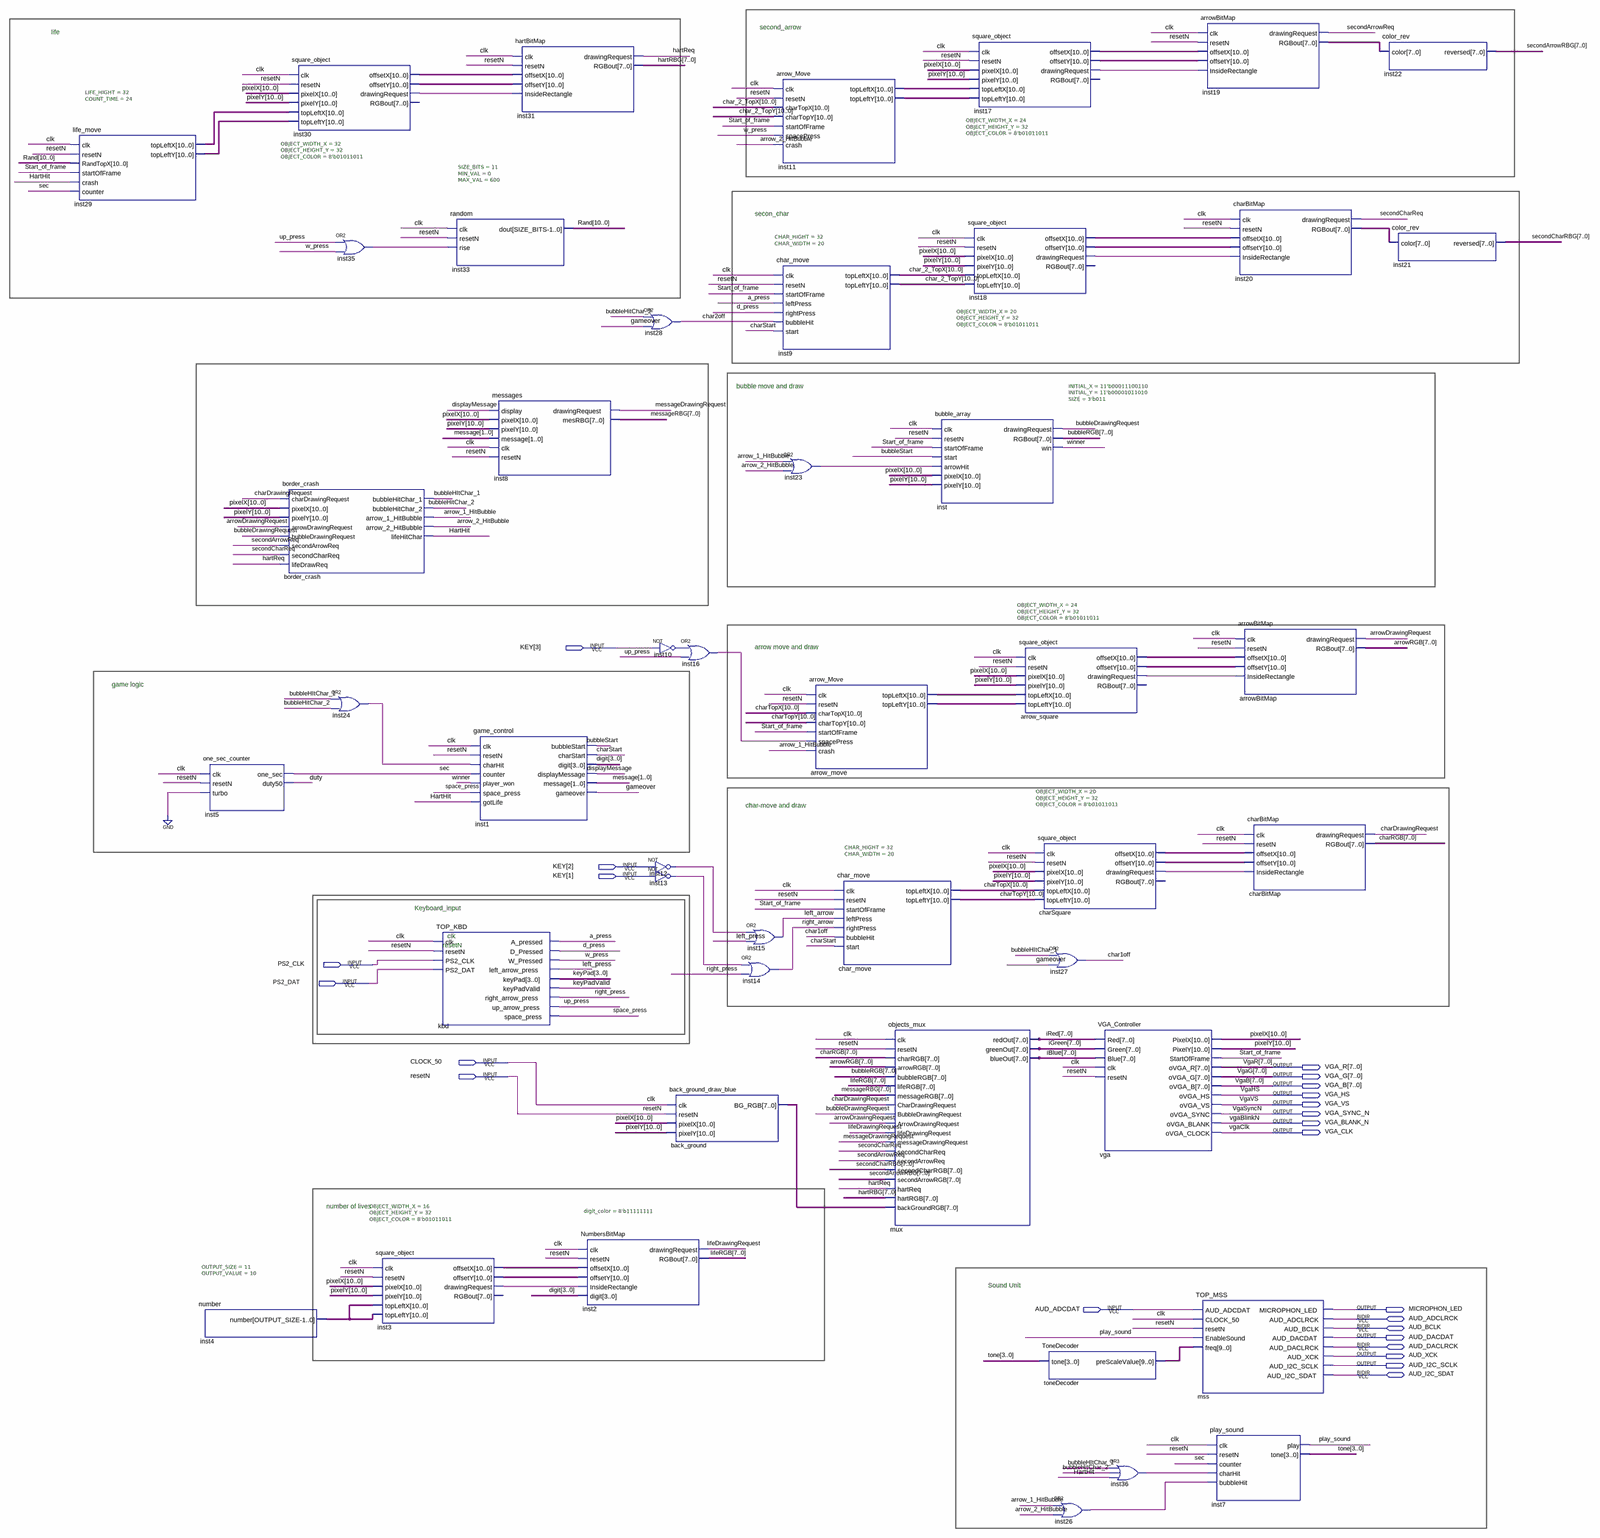
[diagram p0: schematic sheet, whole]
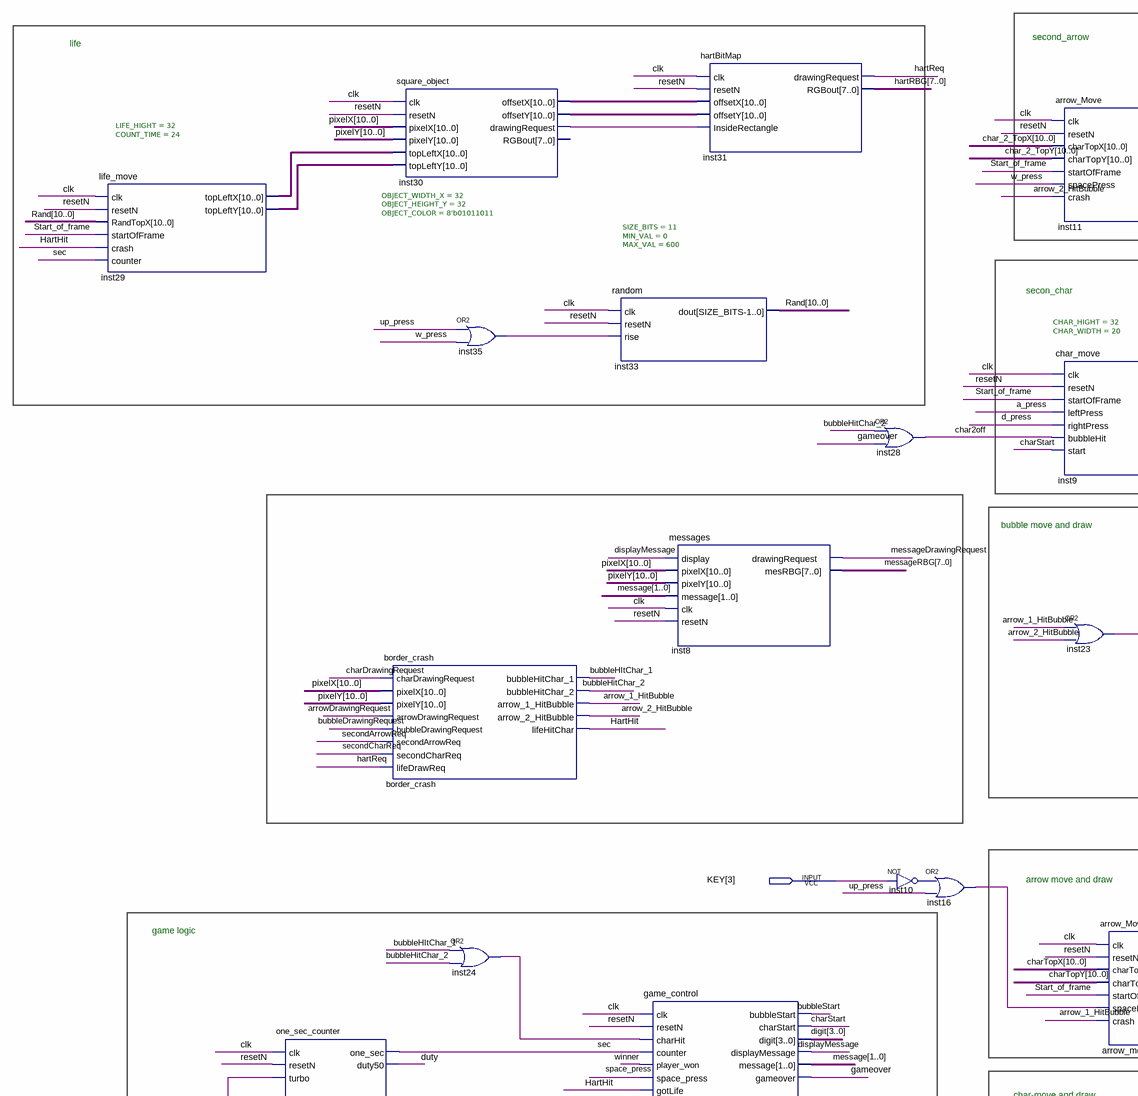
[diagram p1: schematic sheet, upper left part]
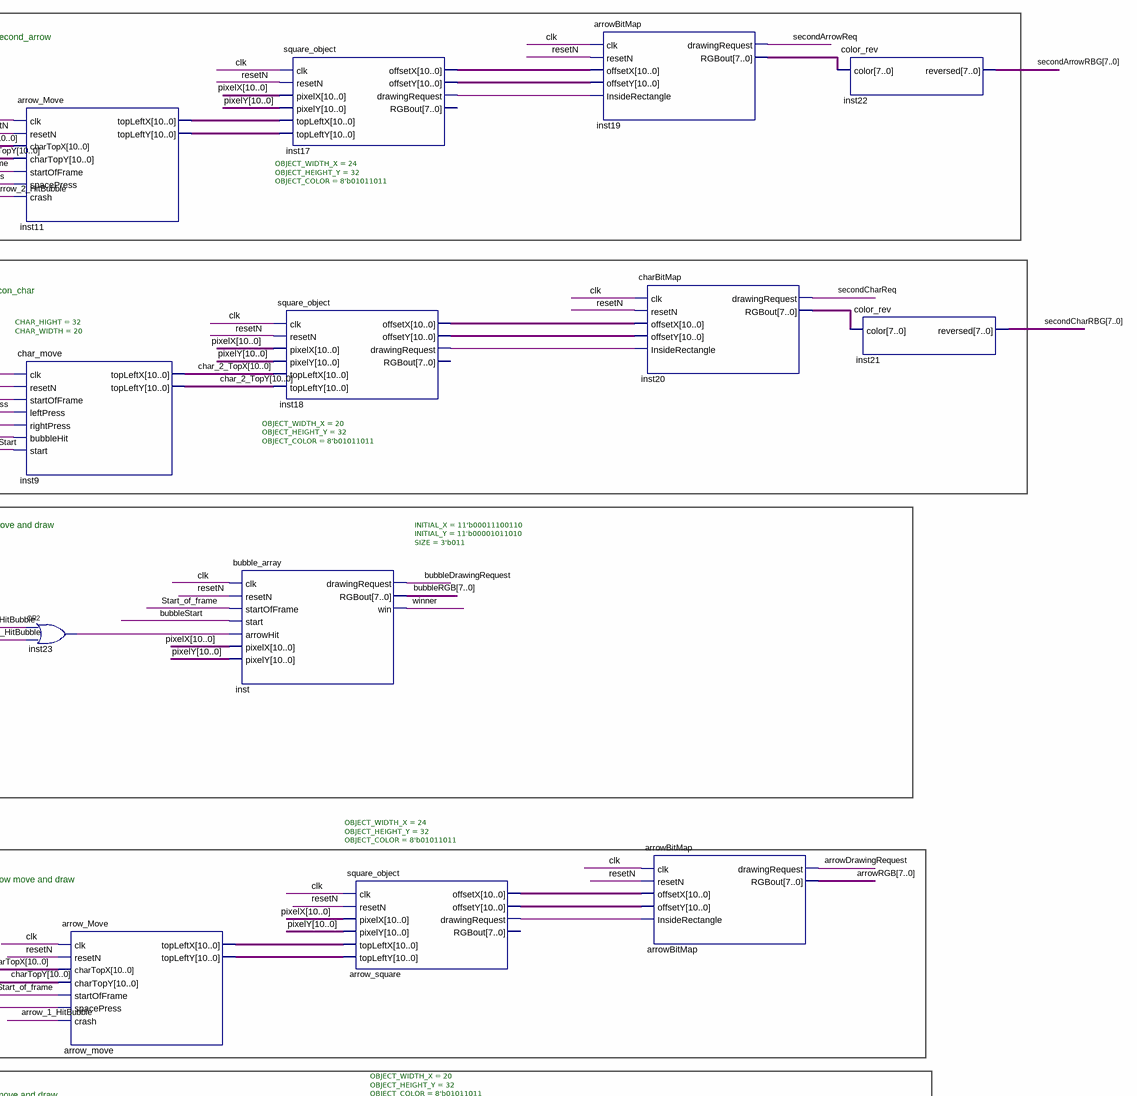
[diagram p2: schematic sheet, upper right part]
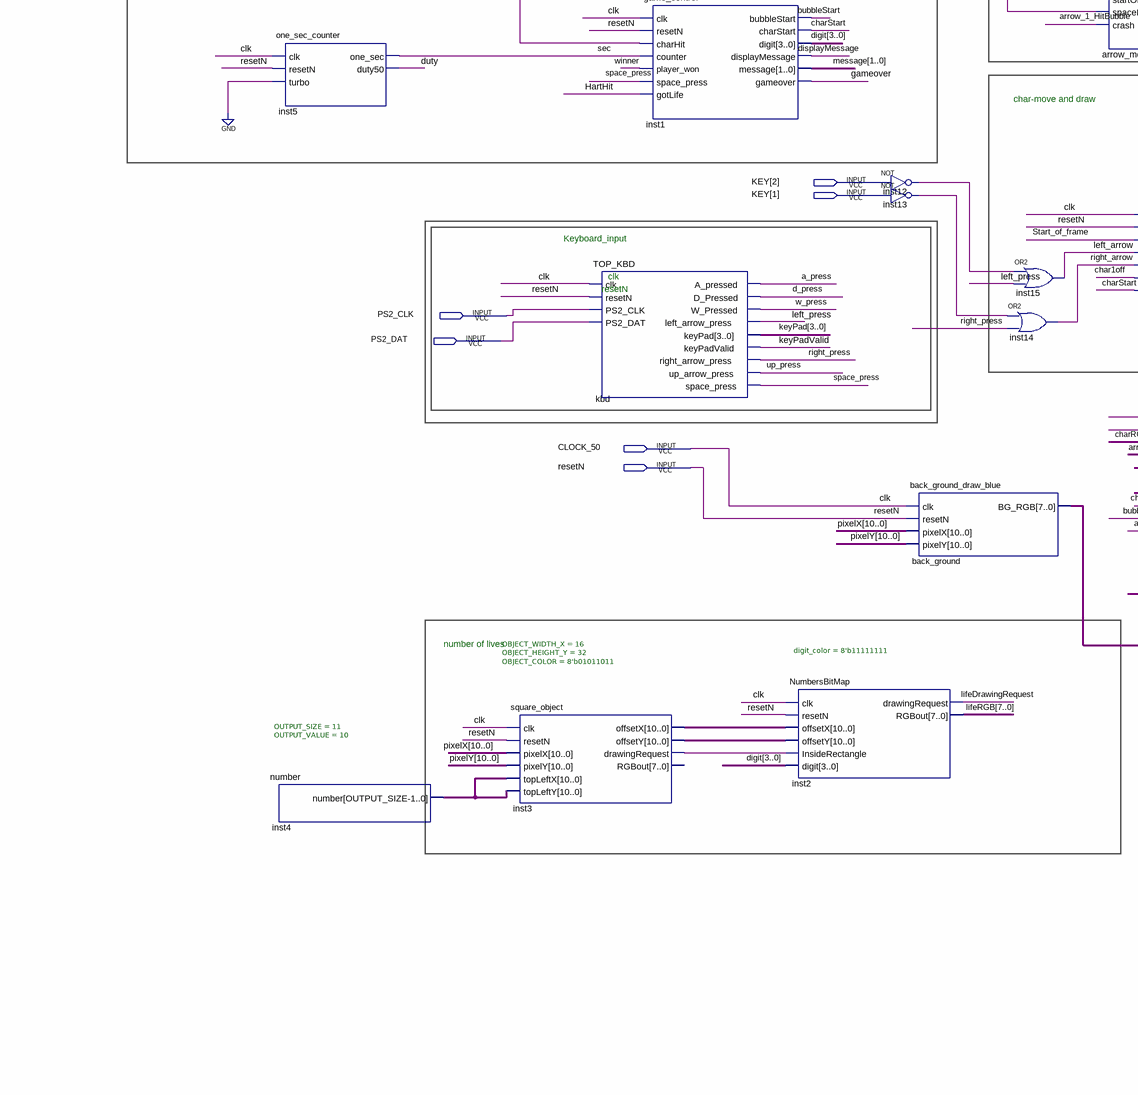
[diagram p3: schematic sheet, lower left part]
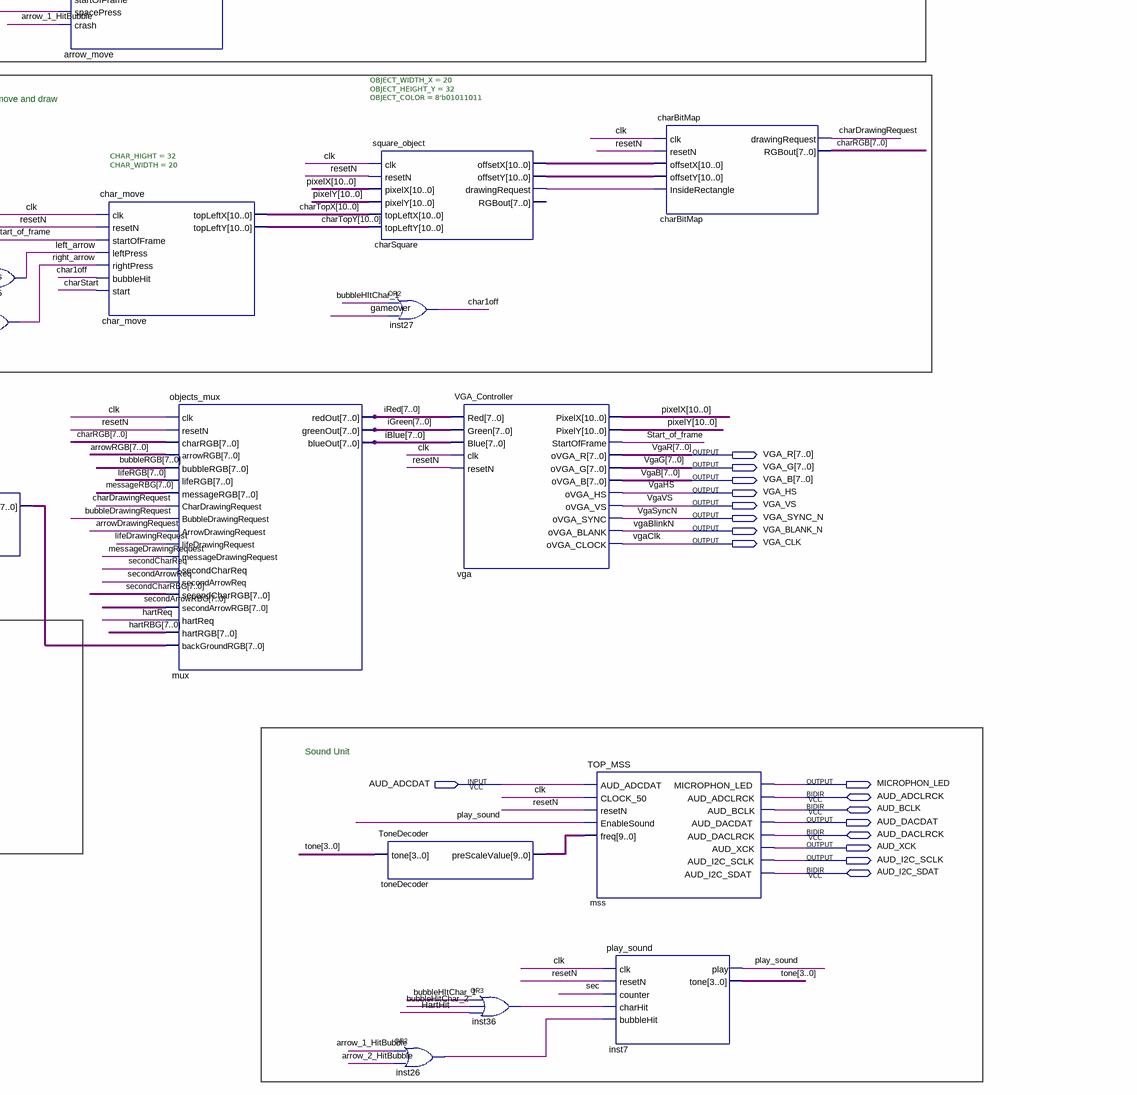
[diagram p4: schematic sheet, lower right part]
// Quartus schematic bubble-trouble-fpga.bdf as structural Verilog: 46 symbols, 24 pins
module \bubble-trouble-fpga  (
  input  [3:1] KEY,
  input  PS2_CLK,
  input  PS2_DAT,
  input  CLOCK_50,
  input  resetN,
  input  AUD_ADCDAT,
  inout  AUD_ADCLRCK,
  inout  AUD_BCLK,
  inout  AUD_DACLRCK,
  inout  AUD_I2C_SDAT,
  output [7:0] VGA_R,
  output [7:0] VGA_G,
  output [7:0] VGA_B,
  output VGA_HS,
  output VGA_VS,
  output VGA_SYNC_N,
  output VGA_BLANK_N,
  output VGA_CLK,
  output MICROPHON_LED,
  output AUD_DACDAT,
  output AUD_XCK,
  output AUD_I2C_SCLK
);

  wire a_press, arrow_1_HitBubble, arrow_2_HitBubble, arrow_square_drawingrequest, arrowDrawingRequest,
       bubbleDrawingRequest, bubbleHItChar_1, bubbleHitChar_2, bubbleStart, char1off, char2off,
       charDrawingRequest, charSquare_drawingrequest, charStart, d_press, displayMessage, duty, gameover,
       HartHit, hartReq, inst3_drawingrequest, inst10_out, inst12_out, inst13_out, inst16_out,
       inst17_drawingrequest, inst18_drawingrequest, inst23_out, inst24_out, inst26_out,
       inst30_drawingrequest, inst35_out, inst36_out, keyPadValid, left_arrow, left_press,
       lifeDrawingRequest, messageDrawingRequest, play_sound, right_arrow, right_press, sec, secondArrowReq,
       secondCharReq, space_press, Start_of_frame, up_press, w_press, winner;
  wire [1:0] message;
  wire [3:0] digit, keyPad, tone;
  wire [7:0] arrowRGB, back_ground_bg_rgb, bubbleRGB, charRGB, hartRBG, iBlue, iGreen, inst19_rgbout,
       inst20_rgbout, iRed, lifeRGB, messageRBG, secondArrowRBG, secondCharRBG;
  wire [9:0] toneDecoder_prescalevalue;
  wire [10:0] arrow_move_topleftx, arrow_move_toplefty, arrow_square_offsetx, arrow_square_offsety,
       char_2_TopX, char_2_TopY, charSquare_offsetx, charSquare_offsety, charTopX, charTopY, inst3_offsetx,
       inst3_offsety, inst4_number, inst11_topleftx, inst11_toplefty, inst17_offsetx, inst17_offsety,
       inst18_offsetx, inst18_offsety, inst29_topleftx, inst29_toplefty, inst30_offsetx, inst30_offsety,
       pixelX, pixelY, Rand;

  life_move #(.LIFE_HIGHT(32), .COUNT_TIME(24)) inst29 (
    .clk(CLOCK_50), .resetN(resetN), .RandTopX(Rand), .startOfFrame(Start_of_frame), .crash(HartHit),
    .counter(sec), .topLeftX(inst29_topleftx), .topLeftY(inst29_toplefty));
  one_sec_counter inst5 (.clk(CLOCK_50), .resetN(resetN), .turbo(1'b0), .one_sec(sec), .duty50(duty));
  number #(.OUTPUT_SIZE(11), .OUTPUT_VALUE(10)) inst4 (.number(inst4_number));
  square_object #(.OBJECT_WIDTH_X(32), .OBJECT_HEIGHT_Y(32), .OBJECT_COLOR(8'b01011011)) inst30 (
    .clk(CLOCK_50), .resetN(resetN), .pixelX(pixelX), .pixelY(pixelY), .topLeftX(inst29_topleftx),
    .topLeftY(inst29_toplefty), .offsetX(inst30_offsetx), .offsetY(inst30_offsety),
    .drawingRequest(inst30_drawingrequest));  // open: RGBout
  border_crash border_crash (
    .charDrawingRequest(charDrawingRequest), .pixelX(pixelX), .pixelY(pixelY),
    .arrowDrawingRequest(arrowDrawingRequest), .bubbleDrawingRequest(bubbleDrawingRequest),
    .secondArrowReq(secondArrowReq), .secondCharReq(secondCharReq), .lifeDrawReq(hartReq),
    .bubbleHitChar_1(bubbleHItChar_1), .bubbleHitChar_2(bubbleHitChar_2),
    .arrow_1_HitBubble(arrow_1_HitBubble), .arrow_2_HitBubble(arrow_2_HitBubble), .lifeHitChar(HartHit));
  or inst24 (inst24_out, bubbleHItChar_1, bubbleHitChar_2);
  or inst35 (inst35_out, up_press, w_press);
  square_object #(.OBJECT_WIDTH_X(16), .OBJECT_HEIGHT_Y(32), .OBJECT_COLOR(8'b01011011)) inst3 (
    .clk(CLOCK_50), .resetN(resetN), .pixelX(pixelX), .pixelY(pixelY), .topLeftX(inst4_number),
    .topLeftY(inst4_number), .offsetX(inst3_offsetx), .offsetY(inst3_offsety),
    .drawingRequest(inst3_drawingrequest));  // open: RGBout
  TOP_KBD kbd (
    .clk(CLOCK_50), .resetN(resetN), .PS2_CLK(PS2_CLK), .PS2_DAT(PS2_DAT), .A_pressed(a_press),
    .D_Pressed(d_press), .W_Pressed(w_press), .left_arrow_press(left_press), .keyPad(keyPad),
    .keyPadValid(keyPadValid), .right_arrow_press(right_press), .up_arrow_press(up_press),
    .space_press(space_press));
  random #(.SIZE_BITS(11), .MIN_VAL(0), .MAX_VAL(600)) inst33 (
    .clk(CLOCK_50), .resetN(resetN), .rise(inst35_out), .dout(Rand));
  game_control inst1 (
    .clk(CLOCK_50), .resetN(resetN), .charHit(inst24_out), .counter(sec), .player_won(winner),
    .space_press(space_press), .gotLife(HartHit), .bubbleStart(bubbleStart), .charStart(charStart),
    .digit(digit), .displayMessage(displayMessage), .message(message), .gameover(gameover));
  hartBitMap inst31 (
    .clk(CLOCK_50), .resetN(resetN), .offsetX(inst30_offsetx), .offsetY(inst30_offsety),
    .InsideRectangle(inst30_drawingrequest), .drawingRequest(hartReq), .RGBout(hartRBG));
  messages inst8 (
    .display(displayMessage), .pixelX(pixelX), .pixelY(pixelY), .message(message), .clk(CLOCK_50),
    .resetN(resetN), .drawingRequest(messageDrawingRequest), .mesRBG(messageRBG));
  NumbersBitMap #(.digit_color(8'b11111111)) inst2 (
    .clk(CLOCK_50), .resetN(resetN), .offsetX(inst3_offsetx), .offsetY(inst3_offsety),
    .InsideRectangle(inst3_drawingrequest), .digit(digit), .drawingRequest(lifeDrawingRequest),
    .RGBout(lifeRGB));
  or inst28 (char2off, bubbleHitChar_2, gameover);
  not inst10 (inst10_out, KEY[3]);
  not inst12 (inst12_out, KEY[2]);
  not inst13 (inst13_out, KEY[1]);
  back_ground_draw_blue back_ground (
    .clk(CLOCK_50), .resetN(resetN), .pixelX(pixelX), .pixelY(pixelY), .BG_RGB(back_ground_bg_rgb));
  or inst16 (inst16_out, inst10_out, up_press);
  or inst14 (right_arrow, inst13_out, right_press);
  arrow_Move inst11 (
    .clk(CLOCK_50), .resetN(resetN), .charTopX(char_2_TopX), .charTopY(char_2_TopY),
    .startOfFrame(Start_of_frame), .spacePress(w_press), .crash(arrow_2_HitBubble),
    .topLeftX(inst11_topleftx), .topLeftY(inst11_toplefty));
  char_move #(.CHAR_HIGHT(32), .CHAR_WIDTH(20)) inst9 (
    .clk(CLOCK_50), .resetN(resetN), .startOfFrame(Start_of_frame), .leftPress(a_press),
    .rightPress(d_press), .bubbleHit(char2off), .start(charStart), .topLeftX(char_2_TopX),
    .topLeftY(char_2_TopY));
  or inst15 (left_arrow, inst12_out, left_press);
  or inst23 (inst23_out, arrow_1_HitBubble, arrow_2_HitBubble);
  arrow_Move arrow_move (
    .clk(CLOCK_50), .resetN(resetN), .charTopX(charTopX), .charTopY(charTopY), .startOfFrame(Start_of_frame),
    .spacePress(inst16_out), .crash(arrow_1_HitBubble), .topLeftX(arrow_move_topleftx),
    .topLeftY(arrow_move_toplefty));
  char_move #(.CHAR_HIGHT(32), .CHAR_WIDTH(20)) char_move (
    .clk(CLOCK_50), .resetN(resetN), .startOfFrame(Start_of_frame), .leftPress(left_arrow),
    .rightPress(right_arrow), .bubbleHit(char1off), .start(charStart), .topLeftX(charTopX),
    .topLeftY(charTopY));
  objects_mux mux (
    .clk(CLOCK_50), .resetN(resetN), .charRGB(charRGB), .arrowRGB(arrowRGB), .bubbleRGB(bubbleRGB),
    .lifeRGB(lifeRGB), .messageRGB(messageRBG), .CharDrawingRequest(charDrawingRequest),
    .BubbleDrawingRequest(bubbleDrawingRequest), .ArrowDrawingRequest(arrowDrawingRequest),
    .lifeDrawingRequest(lifeDrawingRequest), .messageDrawingRequest(messageDrawingRequest),
    .secondCharReq(secondCharReq), .secondArrowReq(secondArrowReq), .secondCharRGB(secondCharRBG),
    .secondArrowRGB(secondArrowRBG), .hartReq(hartReq), .hartRGB(hartRBG),
    .backGroundRGB(back_ground_bg_rgb), .redOut(iRed), .greenOut(iGreen), .blueOut(iBlue));
  square_object #(.OBJECT_WIDTH_X(20), .OBJECT_HEIGHT_Y(32), .OBJECT_COLOR(8'b01011011)) inst18 (
    .clk(CLOCK_50), .resetN(resetN), .pixelX(pixelX), .pixelY(pixelY), .topLeftX(char_2_TopX),
    .topLeftY(char_2_TopY), .offsetX(inst18_offsetx), .offsetY(inst18_offsety),
    .drawingRequest(inst18_drawingrequest));  // open: RGBout
  bubble_array #(.INITIAL_X(11'b00011100110), .INITIAL_Y(11'b00001011010), .SIZE(3'b011)) inst (
    .clk(CLOCK_50), .resetN(resetN), .startOfFrame(Start_of_frame), .start(bubbleStart),
    .arrowHit(inst23_out), .pixelX(pixelX), .pixelY(pixelY), .drawingRequest(bubbleDrawingRequest),
    .RGBout(bubbleRGB), .win(winner));
  square_object #(.OBJECT_WIDTH_X(24), .OBJECT_HEIGHT_Y(32), .OBJECT_COLOR(8'b01011011)) inst17 (
    .clk(CLOCK_50), .resetN(resetN), .pixelX(pixelX), .pixelY(pixelY), .topLeftX(inst11_topleftx),
    .topLeftY(inst11_toplefty), .offsetX(inst17_offsetx), .offsetY(inst17_offsety),
    .drawingRequest(inst17_drawingrequest));  // open: RGBout
  square_object #(.OBJECT_WIDTH_X(24), .OBJECT_HEIGHT_Y(32), .OBJECT_COLOR(8'b01011011)) arrow_square (
    .clk(CLOCK_50), .resetN(resetN), .pixelX(pixelX), .pixelY(pixelY), .topLeftX(arrow_move_topleftx),
    .topLeftY(arrow_move_toplefty), .offsetX(arrow_square_offsetx), .offsetY(arrow_square_offsety),
    .drawingRequest(arrow_square_drawingrequest));  // open: RGBout
  square_object #(.OBJECT_WIDTH_X(20), .OBJECT_HEIGHT_Y(32), .OBJECT_COLOR(8'b01011011)) charSquare (
    .clk(CLOCK_50), .resetN(resetN), .pixelX(pixelX), .pixelY(pixelY), .topLeftX(charTopX),
    .topLeftY(charTopY), .offsetX(charSquare_offsetx), .offsetY(charSquare_offsety),
    .drawingRequest(charSquare_drawingrequest));  // open: RGBout
  ToneDecoder toneDecoder (.tone(tone), .preScaleValue(toneDecoder_prescalevalue));
  or inst27 (char1off, bubbleHItChar_1, gameover);
  or inst26 (inst26_out, arrow_1_HitBubble, arrow_2_HitBubble);
  VGA_Controller vga (
    .Red(iRed), .Green(iGreen), .Blue(iBlue), .clk(CLOCK_50), .resetN(resetN), .PixelX(pixelX),
    .PixelY(pixelY), .StartOfFrame(Start_of_frame), .oVGA_R(VGA_R), .oVGA_G(VGA_G), .oVGA_B(VGA_B),
    .oVGA_HS(VGA_HS), .oVGA_VS(VGA_VS), .oVGA_SYNC(VGA_SYNC_N), .oVGA_BLANK(VGA_BLANK_N), .oVGA_CLOCK(VGA_CLK));
  or inst36 (inst36_out, bubbleHItChar_1, bubbleHitChar_2, HartHit);
  arrowBitMap inst19 (
    .clk(CLOCK_50), .resetN(resetN), .offsetX(inst17_offsetx), .offsetY(inst17_offsety),
    .InsideRectangle(inst17_drawingrequest), .drawingRequest(secondArrowReq), .RGBout(inst19_rgbout));
  TOP_MSS mss (
    .AUD_ADCDAT(AUD_ADCDAT), .CLOCK_50(CLOCK_50), .resetN(resetN), .EnableSound(play_sound),
    .freq(toneDecoder_prescalevalue), .MICROPHON_LED(MICROPHON_LED), .AUD_DACDAT(AUD_DACDAT),
    .AUD_XCK(AUD_XCK), .AUD_I2C_SCLK(AUD_I2C_SCLK), .AUD_ADCLRCK(AUD_ADCLRCK), .AUD_BCLK(AUD_BCLK),
    .AUD_DACLRCK(AUD_DACLRCK), .AUD_I2C_SDAT(AUD_I2C_SDAT));
  play_sound inst7 (
    .clk(CLOCK_50), .resetN(resetN), .counter(sec), .charHit(inst36_out), .bubbleHit(inst26_out),
    .play(play_sound), .tone(tone));
  charBitMap inst20 (
    .clk(CLOCK_50), .resetN(resetN), .offsetX(inst18_offsetx), .offsetY(inst18_offsety),
    .InsideRectangle(inst18_drawingrequest), .drawingRequest(secondCharReq), .RGBout(inst20_rgbout));
  arrowBitMap arrowBitMap (
    .clk(CLOCK_50), .resetN(resetN), .offsetX(arrow_square_offsetx), .offsetY(arrow_square_offsety),
    .InsideRectangle(arrow_square_drawingrequest), .drawingRequest(arrowDrawingRequest), .RGBout(arrowRGB));
  charBitMap charBitMap (
    .clk(CLOCK_50), .resetN(resetN), .offsetX(charSquare_offsetx), .offsetY(charSquare_offsety),
    .InsideRectangle(charSquare_drawingrequest), .drawingRequest(charDrawingRequest), .RGBout(charRGB));
  color_rev inst22 (.color(inst19_rgbout), .reversed(secondArrowRBG));
  color_rev inst21 (.color(inst20_rgbout), .reversed(secondCharRBG));

  // Other names for the same wires on the sheet: clk = CLOCK_50; VgaB[7:0] = VGA_B; vgaBlinkN = VGA_BLANK_N;
  //   vgaClk = VGA_CLK; VgaG[7:0] = VGA_G; VgaHS = VGA_HS; VgaR[7:0] = VGA_R; VgaSyncN = VGA_SYNC_N; VgaVS = VGA_VS

  // Notes on the sheet:
  //   second_arrow
  //   life
  //   secon_char
  //   bubble move and draw
  //   arrow move and draw
  //   game logic
  //   char-move and draw
  //   Keyboard_input
  //   clk
  //   resetN
  //   number of lives
  //   Sound Unit
endmodule
